# EAGLE schematic quarz-pendler (EAGLE 6.1)
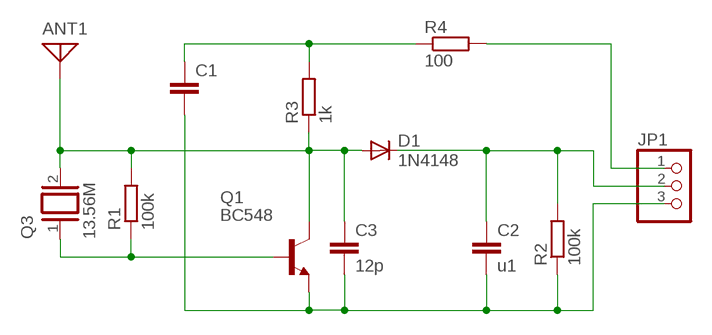
[diagram p0: schematic, sheet 1]

## Parts
ANT1  ANTENNA  [PAD-01]
C1  C-EU025-025X050  [C025-025X050]
C2  u1  C-EU025-025X050  [C025-025X050]
C3  12p  C-EU025-025X050  [C025-025X050]
D1  1N4148  DIODE-D-2.5  [D-2.5]
JP1  PINHD-1X3  [1X03]
Q1  BC548  [TO92-EBC]
Q3  13.56M  XTAL  [Q]
R1  100k  R-EU_0207/2V  [0207/2V]
R2  100k  R-EU_0207/2V  [0207/2V]
R3  1k  R-EU_0207/2V  [0207/2V]
R4  100  R-EU_0207/2V  [0207/2V]

## Nets
+5: JP1.1 R4.2
DAT: C2.1 D1.C JP1.2 R2.2
GND: C1.2 C2.2 C3.2 JP1.3 Q1.E R2.1
N$1: ANT1.1 C3.1 D1.A Q1.C Q3.2 R1.2 R3.1
N$2: Q1.B Q3.1 R1.1
N$6: C1.1 R3.2 R4.1

## Library data of the parts
ANT1 = discrete:ANTENNA: Antenna
C1-C3 = rcl:C-EU: CAPACITOR, European symbol
D1 = diode:DIODE-: DIODE
JP1 = adafruit:PINHD-1X3: PIN HEADER
Q1 = transistor-npn:BC548*: NPN Transistor
Q3 = special:XTAL: CRYSTAL
R1-R4 = rcl:R-EU_: RESISTOR, European symbol